# Altium schematic sheet Schematic.SchDoc
size A4; SheetNumber: 1; SheetTotal: 3
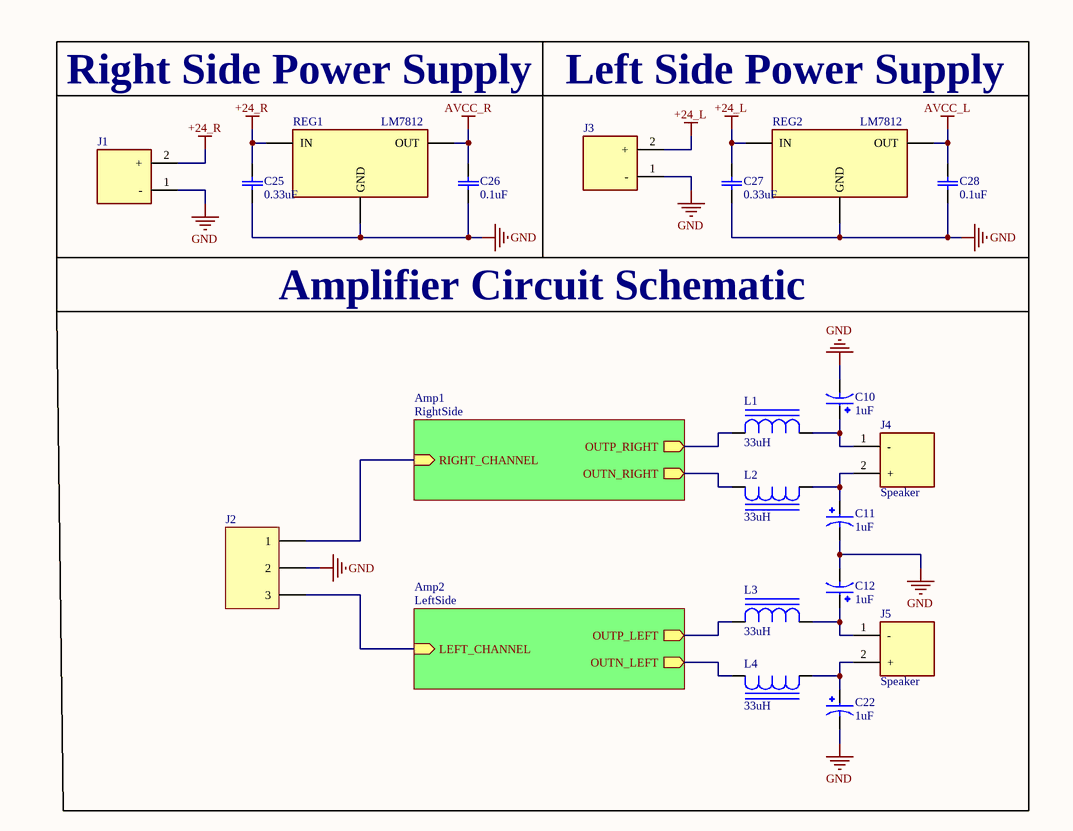
[diagram p0: Schematic.SchDoc]

## Parts
C10  1uF  [CAPRADIAL_16X10]
C11  1uF  [CAPRADIAL_16X10]
C12  1uF  [CAPRADIAL_16X10]
C22  1uF  [CAPRADIAL_16X10]
C25  0.33uF  [CERAMIC0805]
C26  0.1uF  [CERAMIC0805]
C27  0.33uF  [CERAMIC0805]
C28  0.1uF  [CERAMIC0805]
J1  Borne KF301-2P  [Borne KF301-2P]  (value not drawn)
J2  Borne KF301-3P  [Borne KF301-3P]  (value not drawn)
J3  Borne KF301-2P  [Borne KF301-2P]  (value not drawn)
J4  Speaker  [Borne KF301-2P]
J5  Speaker  [Borne KF301-2P]
L1  33uH  [DR124]
L2  33uH  [DR124]
L3  33uH  [DR124]
L4  33uH  [DR124]
REG1  LM7812  [TO-220-3]
REG2  LM7812  [TO-220-3]

## Sub-sheets
Amp1 = RightSide: RIGHT_CHANNEL (in), OUTP_RIGHT (out), OUTN_RIGHT (out)
Amp2 = LeftSide: LEFT_CHANNEL (in), OUTP_LEFT (out), OUTN_LEFT (out)

## Nets
+24_L: C27.2(C2) J3.2(+) REG2.1(IN)
+24_R: C25.2(C2) J1.2(+) REG1.1(IN)
AVCC_L: C28.2(C2) REG2.3(OUT)
AVCC_R: C26.2(C2) REG1.3(OUT)
GND: C10.N C11.N C12.N C22.N C25.1(C1) C26.1(C1) C27.1(C1) C28.1(C1) J1.1(-) J2.2 J3.1(-) REG1.2(GND) REG2.2(GND)
NetC10_P: C10.P J4.1(-) L1.2
NetC11_P: C11.P J4.2(+) L2.1
NetC12_P: C12.P J5.1(-) L3.2
NetC22_P: C22.P J5.2(+) L4.1
NetJ2_1: J2.1 ; sheet Amp1/RIGHT_CHANNEL
NetJ2_3: J2.3 ; sheet Amp2/LEFT_CHANNEL
NetL1_1: L1.1 ; sheet Amp1/OUTP_RIGHT
NetL2_2: L2.2 ; sheet Amp1/OUTN_RIGHT
NetL3_1: L3.1 ; sheet Amp2/OUTP_LEFT
NetL4_2: L4.2 ; sheet Amp2/OUTN_LEFT

## Notes on the sheet
- Right Side Power Supply
- Left Side Power Supply
- Amplifier Circuit Schematic

## Library data of the parts
C10-C12 C22 = CAP ELETRO/TANT: MP: EEU-EE2W560; MF: Panasonic; Digi-Key_Part_Number: P13679-ND; Check_prices: https://www.snapeda.com/parts/EEU-EE2W560/Panasonic/view-part/2337485/?ref=eda; Value: *; SnapEDA_Link: https://www.snapeda.com/parts/EEU-EE2W560/Panasonic/view-part/2337485/?ref=snap; Purchase-URL: https://pricing.snapeda.com/search/part/EEU-EE2W560/?ref=eda; Package: RADIAL-2 Panasonic
C25-C28 = Cap: MF: KEMET; MP: TAJC226M025RNJ; SnapEDA_Link: https://www.snapeda.com/parts/TAJC226M025RNJ/KEMET/view-part/?ref=snap; Availability: In Stock; Price: None; Purchase-URL: https://pricing.snapeda.com/search/part/TAJC226M025RNJ/?ref=eda; Package: None; Check_prices: https://www.snapeda.com/parts/TAJC226M025RNJ/KEMET/view-part/?ref=eda; Value: *
J1 J3-J5 = Borne KF301-2P: 2 Pin Terminal Block 5mm Pitch; Price: None; Value: *; MP: KF301-2P; Package: None; Availability: Unavailable
L1-L4 = Inductor
REG1 REG2 = LM78XX: Regulador de tensão linha LM78XX; MP: LM7805S/NOPB; MF: Texas Instruments; Check_prices: https://www.snapeda.com/parts/LM7805S/NOPB/Texas+Instruments/view-part/?ref=eda; Value: *; Availability: In Stock; Price: None; Package: TO-263-3 Texas Instruments; SnapEDA_Link: https://www.snapeda.com/parts/LM7805S/NOPB/Texas+Instruments/view-part/?ref=snap; Purchase-URL: https://pricing.snapeda.com/search/part/LM7805S/NOPB/?ref=eda